# Altium project CtlQFP.PrjPcb (part 2 of 2)

## Sheet Output13-21.SchDoc
size 594 x 420 mm; SheetNumber: 8; SheetTotal: 10; Обозначение документа: QFP output13-21; Общее количество листов: 10
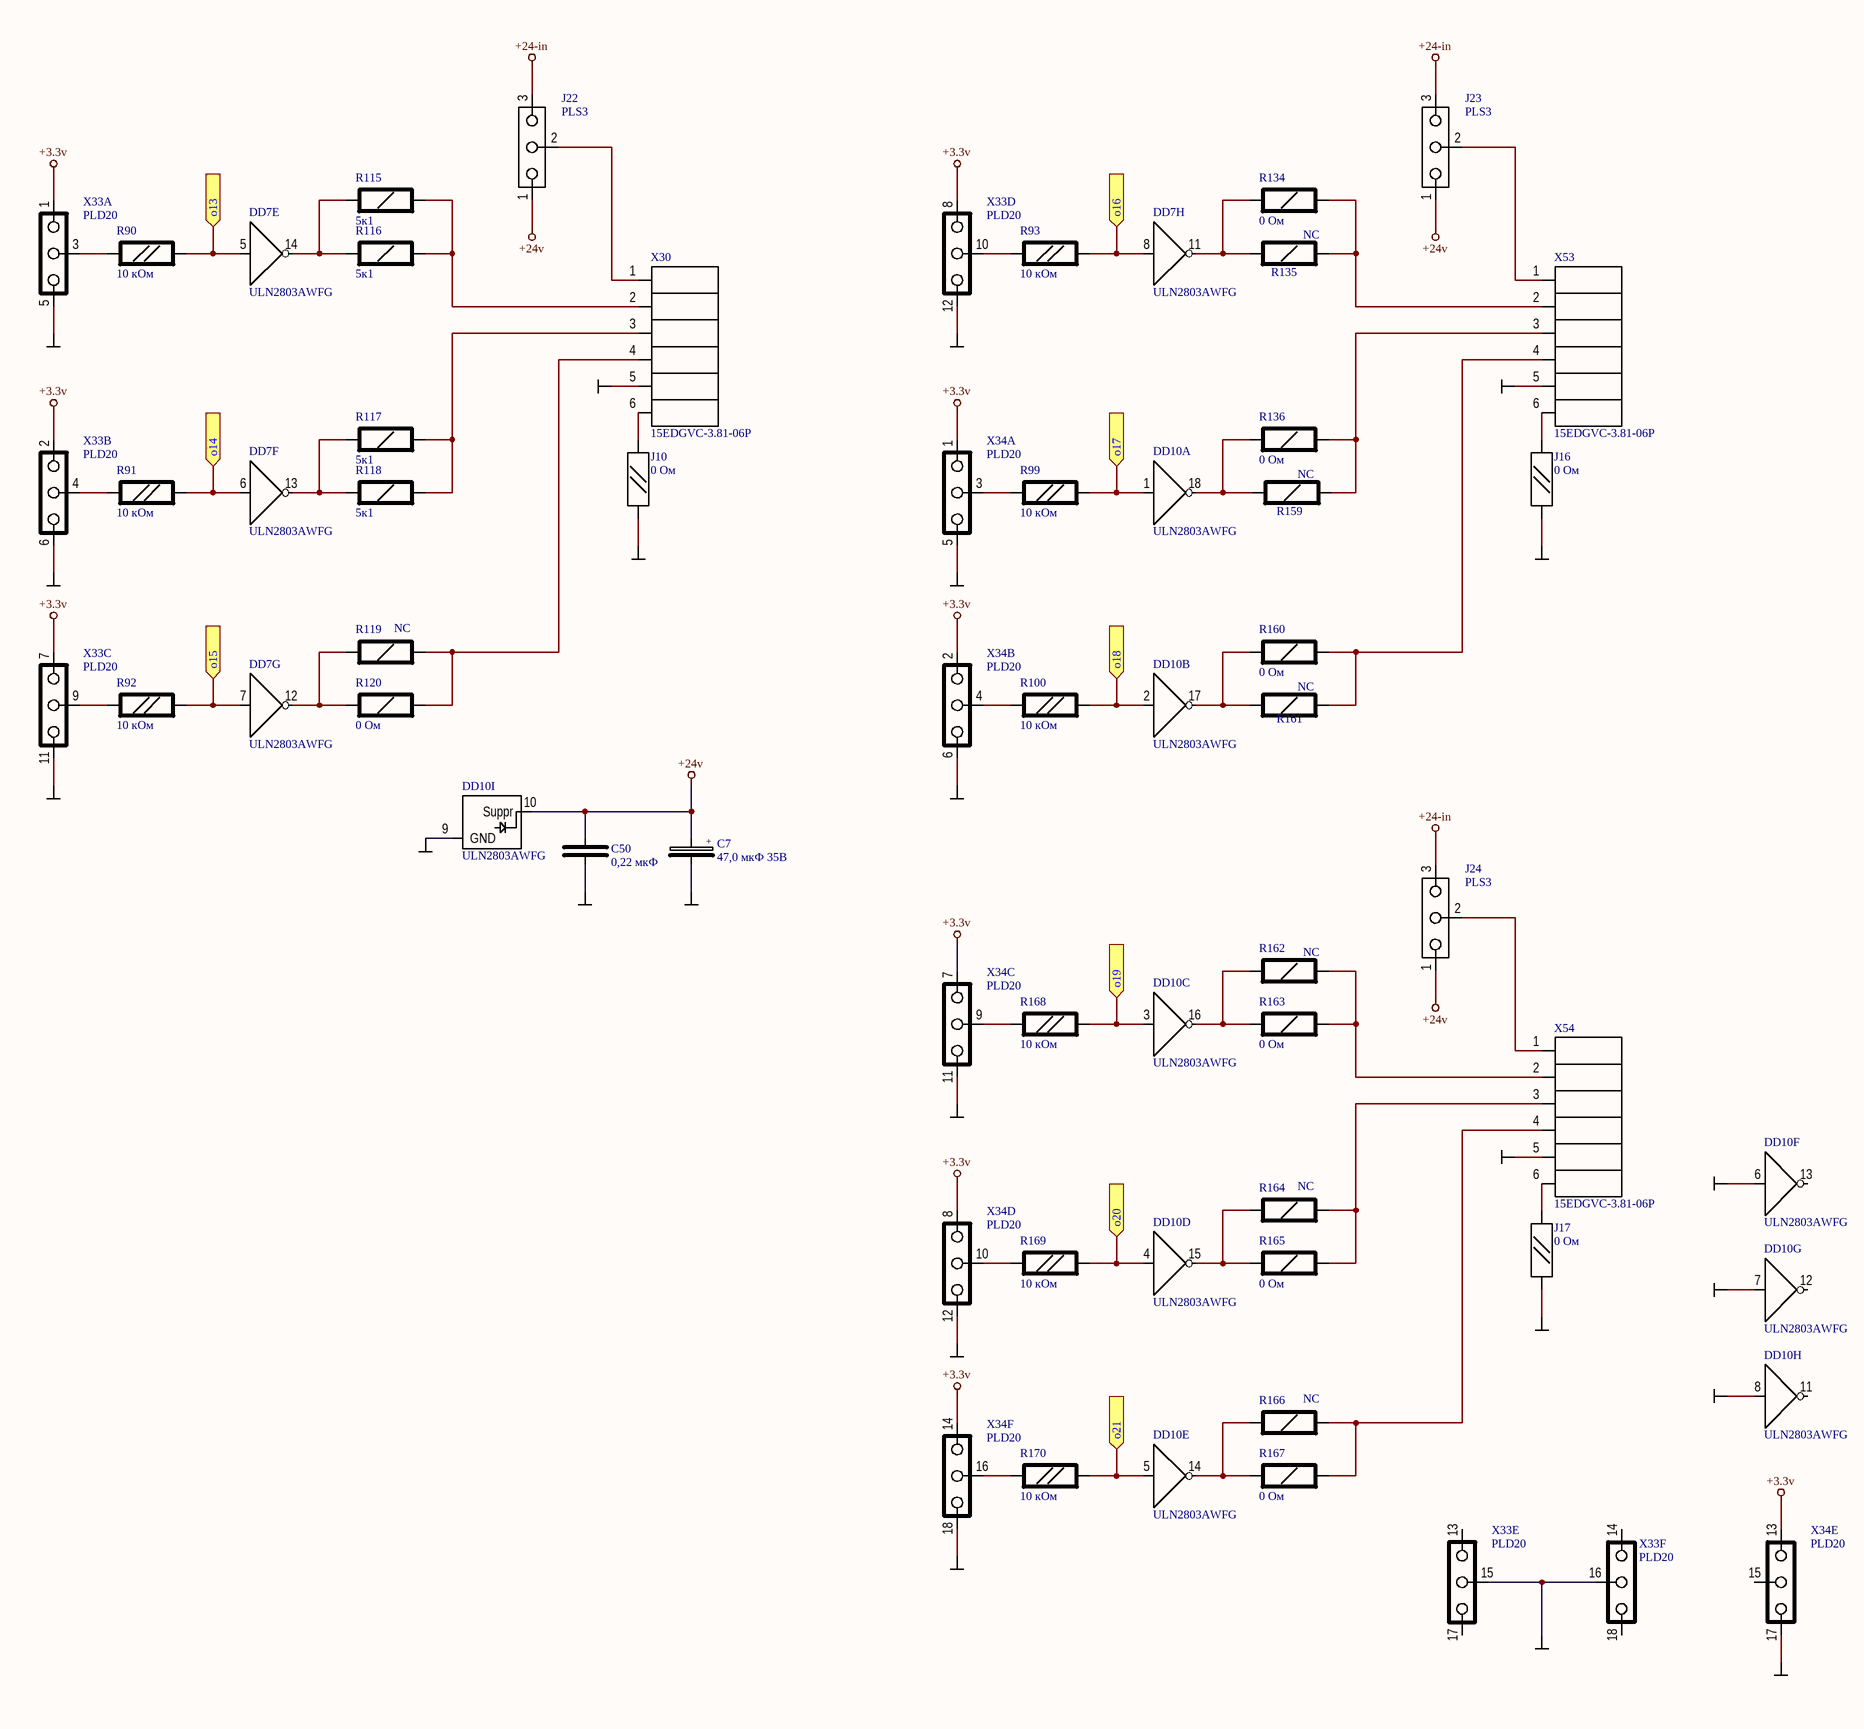
[diagram p9: Output13-21.SchDoc]

### Parts
C7  47,0 мкФ 35В  [cap6]
C50  0,22 мкФ  [SMD0805CAP]
DD7  ULN2803AWFG  [SOL18]  (parts E,F,G,H of 9)
DD10  ULN2803AWFG  [SOL18]  (parts A,B,C,D,E,F,G,H,I of 9)
J10  0 Ом  [SMD0805RES]
J16  0 Ом  [SMD0805RES]
J17  0 Ом  [SMD0805RES]
J22  PLS3  [HDR1X3]
J23  PLS3  [HDR1X3]
J24  PLS3  [HDR1X3]
R90  10 кОм  [SMD0805RES]
R91  10 кОм  [SMD0805RES]
R92  10 кОм  [SMD0805RES]
R93  10 кОм  [SMD0805RES]
R99  10 кОм  [SMD0805RES]
R100  10 кОм  [SMD0805RES]
R115  5к1  [RES1206]
R116  5к1  [RES1206]
R117  5к1  [RES1206]
R118  5к1  [RES1206]
R119  SolderOpton: NC  [RES1206]
R120  0 Ом  [RES1206]
R134  0 Ом  [RES1206]
R135  SolderOpton: NC  [RES1206]
R136  0 Ом  [RES1206]
R159  SolderOpton: NC  [RES1206]
R160  0 Ом  [RES1206]
R161  SolderOpton: NC  [RES1206]
R162  SolderOpton: NC  [RES1206]
R163  0 Ом  [RES1206]
R164  SolderOpton: NC  [RES1206]
R165  0 Ом  [RES1206]
R166  SolderOpton: NC  [RES1206]
R167  0 Ом  [RES1206]
R168  10 кОм  [SMD0805RES]
R169  10 кОм  [SMD0805RES]
R170  10 кОм  [SMD0805RES]
X30  15EDGVC-3.81-06P  [15EDGVC_081_6]
X33  PLD20  [pld2x10_1.27]  (parts A,B,C,D,E,F of 7)
X34  PLD20  [pld2x10_1.27]  (parts A,B,C,D,E,F of 7)
X53  15EDGVC-3.81-06P  [15EDGVC_081_6]
X54  15EDGVC-3.81-06P  [15EDGVC_081_6]

### Ports
o13 (in), o14 (in), o15 (in), o16 (in), o17 (in), o18 (in), o19 (in), o20 (in), o21 (in)

### Nets
+3.3v: X33.1 X33.2 X33.7 X33.8 X34.1 X34.2 X34.7 X34.8 X34.13 X34.14
+24-in: J22.3(Left) J23.3(Left) J24.3(Left)
+24v: C7.1(+) C50.1 DD10.10(Suppr) J22.1(Right) J23.1(Right) J24.1(Right)
GND: C7.2(-) C50.2 DD10.6(In) DD10.7(In) DD10.8(In) DD10.9(GND) J10.2 J16.2 J17.2 X30.5 X33.5 X33.6 X33.11 X33.12 X33.15 X33.16 X34.5 X34.6 X34.11 X34.12 X34.17 X34.18 X53.5 X54.5
NetDD7_5: DD7.5(In) R90.1 ; port o13
NetDD7_6: DD7.6(In) R91.1 ; port o14
NetDD7_7: DD7.7(In) R92.1 ; port o15
NetDD7_8: DD7.8(In) R93.1 ; port o16
NetDD7_11: DD7.11(OUT) R134.2 R135.2
NetDD7_12: DD7.12(OUT) R119.2 R120.2
NetDD7_13: DD7.13(OUT) R117.2 R118.2
NetDD7_14: DD7.14(OUT) R115.2 R116.2
NetDD8_24: DD10.1(In) R99.1 ; port o17
NetDD8_31: DD10.2(In) R100.1 ; port o18
NetDD8_32: DD10.3(In) R168.1 ; port o19
NetDD8_67: DD10.4(In) R169.1 ; port o20
NetDD8_68: DD10.5(In) R170.1 ; port o21
NetDD10_14: DD10.14(OUT) R166.2 R167.2
NetDD10_15: DD10.15(OUT) R164.2 R165.2
NetDD10_16: DD10.16(OUT) R162.2 R163.2
NetDD10_17: DD10.17(OUT) R160.2 R161.2
NetDD10_18: DD10.18(OUT) R136.2 R159.2
NetJ10_1: J10.1 X30.6
NetJ16_1: J16.1 X53.6
NetJ17_1: J17.1 X54.6
NetJ22_2: J22.2(Cetnter) X30.1
NetJ23_2: J23.2(Cetnter) X53.1
NetJ24_2: J24.2(Cetnter) X54.1
NetR90_2: R90.2 X33.3
NetR91_2: R91.2 X33.4
NetR92_2: R92.2 X33.9
NetR93_2: R93.2 X33.10
NetR99_2: R99.2 X34.3
NetR100_2: R100.2 X34.4
NetR115_1: R115.1 R116.1 X30.2
NetR117_1: R117.1 R118.1 X30.3
NetR119_1: R119.1 R120.1 X30.4
NetR134_1: R134.1 R135.1 X53.2
NetR136_1: R136.1 R159.1 X53.3
NetR160_1: R160.1 R161.1 X53.4
NetR162_1: R162.1 R163.1 X54.2
NetR164_1: R164.1 R165.1 X54.3
NetR166_1: R166.1 R167.1 X54.4
NetR168_2: R168.2 X34.9
NetR169_2: R169.2 X34.10
NetR170_2: R170.2 X34.16

Not connected (* = marked no-connect by the designer): DD10 11(OUT) 12(OUT) 13(OUT); X33 13 14 17 18; X34 15

### Notes on the sheet
- Подп. и дата
- Инв. № дубл.
- Взам. инв. №
- Инв. № подл.
- Изм.
- Лист
- № докум.
- Подп.
- Дата
- Копировал
- Формат А2

### Library data of the parts
C7 = C_e: 5мм Электролитический конденсатор; SolderOption: Norm; Value: 47,0 мкФ 35В
C50 = C0805: Чип конденсатор 0805; Voltage: 50V; Vendor: Generic; Temp: Y5V; Tol: 20%; SolderOpton: Norm; Value: 0,22 мкФ; Price: 2
DD7 DD10 = ULN2803: Буфер 8-канальный; Vendor: Toshiba; Voltage: 50V; Bandwidth: 15MHz; SolderOption: Norm; Value: ULN2803AWFG; Price: 100
J10 J16 J17 = JR0805: SMD 0805 перемычка; SolderOption: Norm; Price: 2; Vendor: *; Value: 0 Ом
J22-J24 = PLS3: Джампер PLS3 2.54мм; SolderOption: Norm; Price: 1; Vendor: *; Value: PLS3
R90-R93 R99 R100 R168-R170 = R0805: Чип резистор 0805; Vendor: Generic; Tolerance: 5%; SolderOpton: Norm; Price: 2; Value: 10 кОм
R115-R118 R120 R134 R136 R160 R163 R165 R167 = R1206: Чип резистор 1206; Vendor: Generic; Tolerance: 5%; SolderOpton: Norm; Price: 2
  R115-R118: Value: 5к1
  R120 R134 R136 R160 R163 R165 R167: Value: 0 Ом
R119 R135 R159 R161 R162 R164 R166 = R1206: as R2 on sheet input1-9; Price: 2
X30 X53 X54 = 15EDGVC-3.81-06P: Вилка  6/3.81; Vendor: Degson; Current: 8А; Voltage: 2кВ; Price: 50; Value: 15EDGVC-3.81-06P
X33 X34 = PLD20: Вилка  PLD 20/1.27; Vendor: Confly; SolderOption: Norm; Price: 10; Value: PLD20

## Nets that join several sheets
05V_1: AnalogOut (22 pins), Power (6 pins)
024v_1: input1-9 (15 pins), Input10-18 (15 pins), input19-21 (5 pins), Power (X52.1)
+3.3v: input1-9 (9 pins), Input10-18 (9 pins), input19-21 (R198.2 R199.2 R200.2), AnalogOut (C59.1 DD12.1), slave (11 pins), uc (24 pins), Power (5 pins), Output1-12 (12 pins), Output13-21 (10 pins)
+5v: slave (10 pins), Power (9 pins)
+5V_1: AnalogOut (10 pins), Power (DA9.2 DA9.4 R139.1)
+12V_1: AnalogOut (6 pins), Power (5 pins)
+24-in: Power (VD34.2 VD35.2 X50.1 X50.3), Output1-12 (J18.3 J19.3 J20.3 J21.3), Output13-21 (J22.3 J23.3 J24.3)
+24v: Power (13 pins), Output1-12 (10 pins), Output13-21 (6 pins)
+24v_1: input1-9 (12 pins), Input10-18 (12 pins), input19-21 (X12.2 X12.8 X12.14 X25.1), Power (C51.1 C52.1 X21.1)
GND: input1-9 (9 pins), Input10-18 (9 pins), input19-21 (DD5.9 DD5.11 DD11.3), AnalogOut (C59.2 DD12.4), slave (28 pins), uc (22 pins), Power (40 pins), Output1-12 (26 pins), Output13-21 (24 pins)
NetDD1_10: input1-9 (DD1.10 R28.1), uc (DD8.84)
NetDD1_12: input1-9 (DD1.12 R15.1), uc (DD8.83)
NetDD1_14: input1-9 (DD1.14 R14.1), uc (DD8.82)
NetDD1_16: input1-9 (DD1.16 R13.1), uc (DD8.81)
NetDD2_10: input1-9 (DD2.10 R44.1), uc (DD8.88)
NetDD2_12: input1-9 (DD2.12 R43.1), uc (DD8.87)
NetDD2_14: input1-9 (DD2.14 R30.1), uc (DD8.86)
NetDD2_16: input1-9 (DD2.16 R29.1), uc (DD8.85)
NetDD3_10: Input10-18 (DD3.10 R60.1), uc (DD8.58)
NetDD3_12: Input10-18 (DD3.12 R59.1), uc (DD8.57)
NetDD3_14: Input10-18 (DD3.14 R58.1), uc (DD8.56)
NetDD3_16: input1-9 (DD3.16 R45.1), uc (DD8.55)
NetDD4_10: Input10-18 (DD4.10 R171.1), uc (DD8.15)
NetDD4_12: Input10-18 (DD4.12 R75.1), uc (DD8.61)
NetDD4_14: Input10-18 (DD4.14 R74.1), uc (DD8.60)
NetDD4_16: Input10-18 (DD4.16 R73.1), uc (DD8.59)
NetDD5_10: input19-21 (DD5.10 R199.1), uc (DD8.33)
NetDD5_12: input19-21 (DD5.12 R198.1), uc (DD8.18)
NetDD5_14: Input10-18 (DD5.14 R197.1), uc (DD8.17)
NetDD5_16: Input10-18 (DD5.16 R172.1), uc (DD8.16)
NetDD6_1: uc (DD8.1), Output1-12 (DD6.1 R76.1)
NetDD6_2: uc (DD8.5), Output1-12 (DD6.2 R79.1)
NetDD6_3: uc (DD8.38), Output1-12 (DD6.3 R80.1)
NetDD6_4: uc (DD8.2), Output1-12 (DD6.4 R81.1)
NetDD6_5: uc (DD8.39), Output1-12 (DD6.5 R82.1)
NetDD6_6: uc (DD8.40), Output1-12 (DD6.6 R83.1)
NetDD6_7: uc (DD8.3), Output1-12 (DD6.7 R84.1)
NetDD6_8: uc (DD8.41), Output1-12 (DD6.8 R85.1)
NetDD7_1: uc (DD8.42), Output1-12 (DD7.1 R86.1)
NetDD7_2: uc (DD8.4), Output1-12 (DD7.2 R87.1)
NetDD7_3: uc (DD8.43), Output1-12 (DD7.3 R88.1)
NetDD7_4: uc (DD8.44), Output1-12 (DD7.4 R89.1)
NetDD7_5: uc (DD8.92), Output13-21 (DD7.5 R90.1)
NetDD7_6: uc (DD8.45), Output13-21 (DD7.6 R91.1)
NetDD7_7: uc (DD8.46), Output13-21 (DD7.7 R92.1)
NetDD7_8: uc (DD8.23), Output13-21 (DD7.8 R93.1)
NetDD8_7: slave (X46.30), uc (DD8.7)
NetDD8_8: slave (X46.33), uc (DD8.8)
NetDD8_9: slave (X46.34), uc (DD8.9)
NetDD8_24: uc (DD8.24), Output13-21 (DD10.1 R99.1)
NetDD8_25: slave (X47.10), uc (DD8.25)
NetDD8_26: slave (X47.8), uc (DD8.26)
NetDD8_31: uc (DD8.31), Output13-21 (DD10.2 R100.1)
NetDD8_32: uc (DD8.32), Output13-21 (DD10.3 R168.1)
NetDD8_34: input19-21 (DD11.4 R200.1), uc (DD8.34)
NetDD8_35: slave (X46.7), uc (DD8.35)
NetDD8_36: slave (X46.8), uc (DD8.36)
NetDD8_37: slave (X46.9), uc (DD8.37)
NetDD8_47: slave (X46.14), uc (DD8.47)
NetDD8_63: slave (X46.21), uc (DD8.63)
NetDD8_64: slave (X46.22), uc (DD8.64)
NetDD8_65: slave (X46.23), uc (DD8.65)
NetDD8_66: slave (X46.24), uc (DD8.66)
NetDD8_67: uc (DD8.67), Output13-21 (DD10.4 R169.1)
NetDD8_68: uc (DD8.68), Output13-21 (DD10.5 R170.1)
NetDD8_69: slave (X46.1), uc (DD8.69)
NetDD8_70: slave (X46.2), uc (DD8.70)
NetDD8_71: slave (X46.3), uc (DD8.71)
NetDD8_77: slave (X46.4), uc (DD8.77)
NetDD8_78: slave (X46.27), uc (DD8.78)
NetDD8_79: slave (X46.28), uc (DD8.79)
NetDD8_80: slave (X46.29), uc (DD8.80)
NetDD8_90: slave (X46.10), uc (DD8.90)
NetDD8_91: slave (X46.13), uc (DD8.91)
NetDD8_94: slave (J13.1 J31.2 R157.1), uc (DD8.94)
NetDD8_95: AnalogOut (DD12.2), uc (DD8.95)
NetDD8_96: AnalogOut (DD12.3), uc (DD8.96)
nrst: slave (X47.5), uc (DD8.14 R129.1 X22.5)